# EAGLE design sensors (EAGLE 8.1.1)
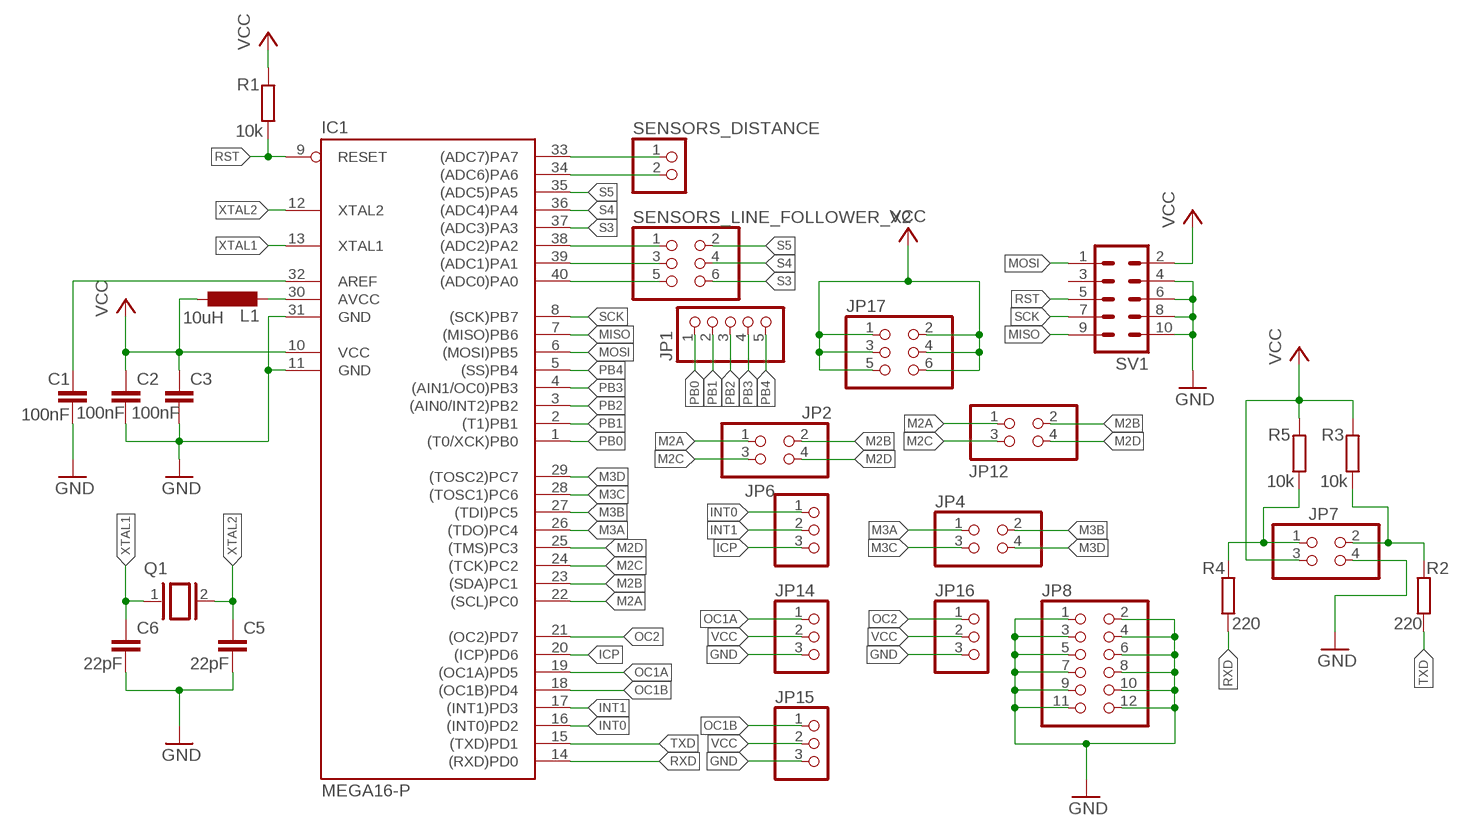
[diagram p0: schematic, sheet 1]

## Parts
C1  100nF  C-EUC0805  [C0805]
C2  100nF  C-EUC0805  [C0805]
C3  100nF  C-EUC0805  [C0805]
C5  22pF  C-EUC0805  [C0805]
C6  22pF  C-EUC0805  [C0805]
IC1  MEGA16-P  [DIL40]
JP1  PINHD-1X5  [1X05]
JP2  PINHD-2X2  [2X02]
JP4  PINHD-2X2  [2X02]
JP6  PINHD-1X3  [1X03]
JP7  PINHD-2X2  [2X02]
JP8  PINHD-2X6  [2X06]
JP12  PINHD-2X2  [2X02]
JP14  PINHD-1X3  [1X03]
JP15  PINHD-1X3  [1X03]
JP16  PINHD-1X3  [1X03]
JP17  PINHD-2X3  [2X03]
L1  10uH  L-EU0207/7  [0207/7]
Q1  XTAL/S  [QS]
R1  10k  R-EU_R0805  [R0805]
R2  220  R-EU_R0805  [R0805]
R3  10k  R-EU_R0805  [R0805]
R4  220  R-EU_R0805  [R0805]
R5  10k  R-EU_R0805  [R0805]
SENSORS_DISTANCE  PINHD-1X2  [1X02]
SENSORS_LINE_FOLLOWER_X2  PINHD-2X3  [2X03]
SV1  ML10  [ML10]

## Nets
ADC6: IC1.34((ADC6)PA6) SENSORS_DISTANCE.2
GND: C1.2 C2.2 C3.2 C5.2 C6.2 IC1.11(GND) IC1.31(GND) JP7.4 JP8.1 JP8.2 JP8.3 JP8.4 JP8.5 JP8.6 JP8.7 JP8.8 JP8.9 JP8.10 JP8.11 JP8.12 JP14.3 JP15.3 JP16.3 SV1.4 SV1.6 SV1.8 SV1.10
ICP: IC1.20((ICP)PD6) JP6.3
INT0: IC1.16((INT0)PD2) JP6.1
INT1: IC1.17((INT1)PD3) JP6.2
M2A: IC1.22((SCL)PC0) JP2.1 JP12.1
M2B: IC1.23((SDA)PC1) JP2.2 JP12.2
M2C: IC1.24((TCK)PC2) JP2.3 JP12.3
M2D: IC1.25((TMS)PC3) JP2.4 JP12.4
M3A: IC1.26((TDO)PC4) JP4.1
M3B: IC1.27((TDI)PC5) JP4.2
M3C: IC1.28((TOSC1)PC6) JP4.3
M3D: IC1.29((TOSC2)PC7) JP4.4
MISO: IC1.7((MISO)PB6) SV1.9
MOSI: IC1.6((MOSI)PB5) SV1.1
N$1: JP7.1 R4.2 R5.1
N$2: JP7.2 R2.2 R3.1
N$3: C1.1 IC1.32(AREF)
N$4: IC1.30(AVCC) L1.2
N$29: IC1.33((ADC7)PA7) SENSORS_DISTANCE.1
OC1A: IC1.19((OC1A)PD5) JP14.1
OC1B: IC1.18((OC1B)PD4) JP15.1
OC2: IC1.21((OC2)PD7) JP16.1
PB0: IC1.1((T0/XCK)PB0) JP1.1
PB1: IC1.2((T1)PB1) JP1.2
PB2: IC1.3((AIN0/INT2)PB2) JP1.3
PB3: IC1.4((AIN1/OC0)PB3) JP1.4
PB4: IC1.5((SS)PB4) JP1.5
RST: IC1.9(RESET) R1.1 SV1.5
RXD: IC1.14((RXD)PD0) R4.1
S0: IC1.40((ADC0)PA0) SENSORS_LINE_FOLLOWER_X2.5
S1: IC1.39((ADC1)PA1) SENSORS_LINE_FOLLOWER_X2.3
S2: IC1.38((ADC2)PA2) SENSORS_LINE_FOLLOWER_X2.1
S3: IC1.37((ADC3)PA3) SENSORS_LINE_FOLLOWER_X2.6
S4: IC1.36((ADC4)PA4) SENSORS_LINE_FOLLOWER_X2.4
S5: IC1.35((ADC5)PA5) SENSORS_LINE_FOLLOWER_X2.2
SCK: IC1.8((SCK)PB7) SV1.7
TXD: IC1.15((TXD)PD1) R2.1
VCC: C2.1 C3.1 IC1.10(VCC) JP7.3 JP14.2 JP15.2 JP16.2 JP17.1 JP17.2 JP17.3 JP17.4 JP17.5 JP17.6 L1.1 R1.2 R3.2 R5.2 SV1.2
XTAL1: C6.1 IC1.13(XTAL1) Q1.1
XTAL2: C5.1 IC1.12(XTAL2) Q1.2
Unconnected: SV1.3

## Library data of the parts
C1-C3 C5 C6 = resistor:C-EU: CAPACITOR, European symbol
IC1 = atmel:MEGA16-P: MICROCONTROLLER 16 Kbytes FLASH 1 kbytes SRAM 512 bytes EEPROM USART 8-channel 10 bit ADC Source: avr.lbr; MPN: ATMEGA16-16PU; OC_FARNELL: 9171142; OC_NEWARK: 01M6885
JP1 = pinhead:PINHD-1X5: PIN HEADER
JP2 JP4 JP7 JP12 = pinhead:PINHD-2X2: PIN HEADER
JP6 JP14-JP16 = pinhead:PINHD-1X3: PIN HEADER
JP8 = pinhead:PINHD-2X6: PIN HEADER
JP17 SENSORS_LINE_FOLLOWER_X2 = pinhead:PINHD-2X3: PIN HEADER
L1 = resistor:L-EU: INDUCTOR, European symbol
Q1 = special:XTAL/S: CRYSTAL
R1-R5 = resistor:R-EU_: RESISTOR, European symbol
SENSORS_DISTANCE = pinhead:PINHD-1X2: PIN HEADER
SV1 = con-ml:ML10: HARTING; OC_FARNELL: unknown; OC_NEWARK: unknown

## Board
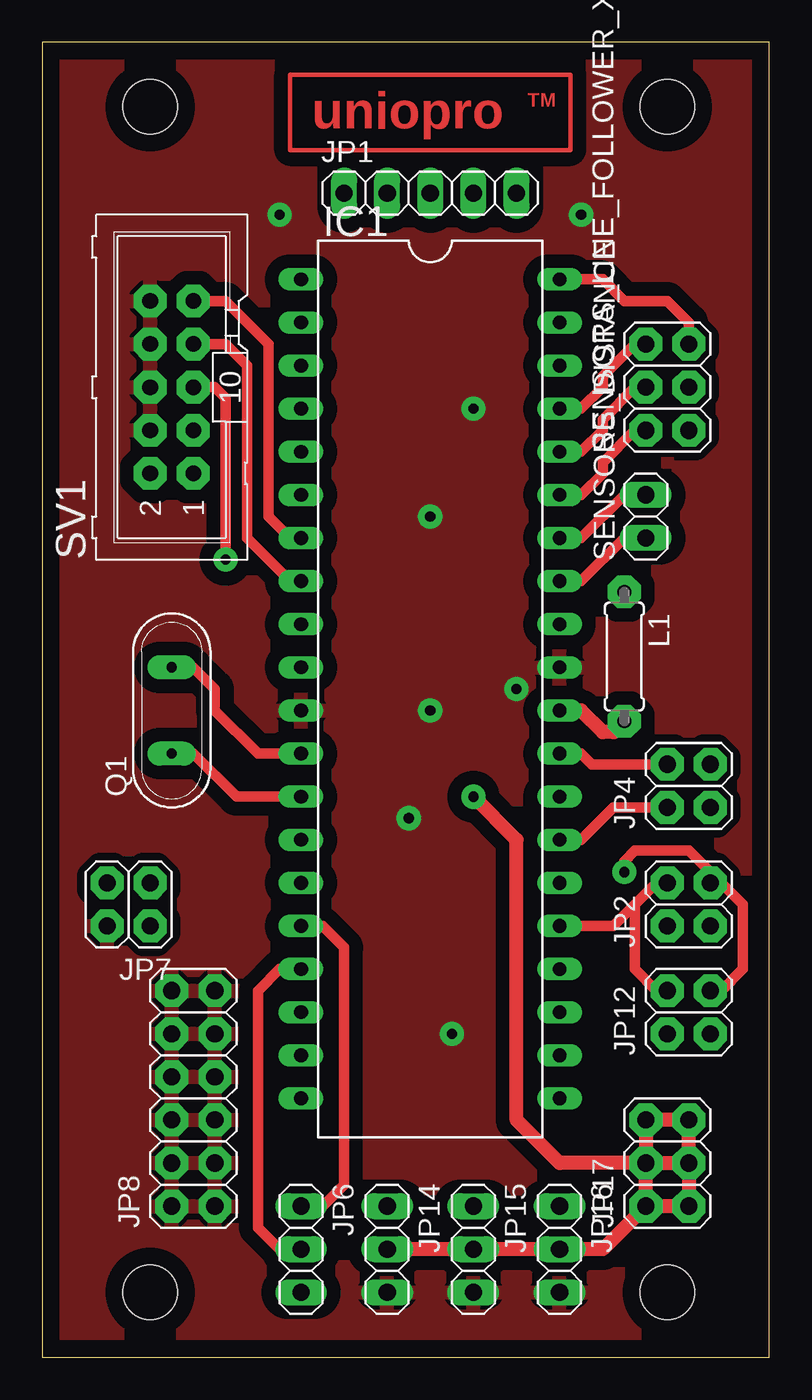
[diagram p1: board, top side]
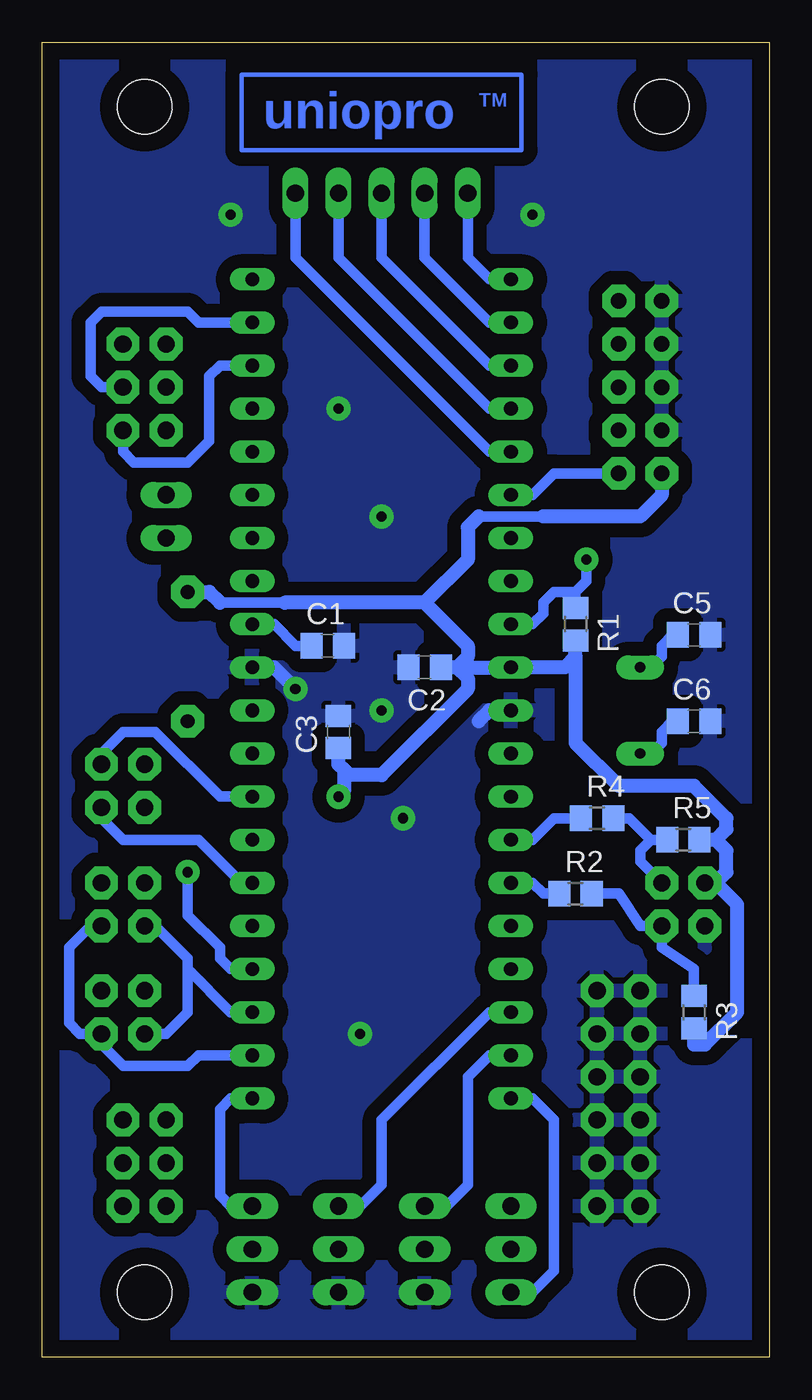
[diagram p2: board, bottom side, seen from below]

Size 42.85 x 77.46 mm. Coordinates in mm from the lower left corner, seen from the top.
Outline: 0,0 42.85,0 42.85,77.46 0,77.46 0,0
Copper layers (1*16): Top 0.035mm / dielectric 1.5mm / Bottom 0.035mm
Design rules "default": minimum track width 10mil, minimum drill 24mil, track to track 8mil, track to pad 8mil, pad to pad 8mil, via to via 8mil, smd to smd 8mil, copper to edge 40mil, drill to drill 8mil, minimum pad ring 10mil, minimum via ring 8mil, stop-mask expansion 4mil, vias tented up to drill 0mil, thermal gap 10mil
Holes 3.2 mm at 36.83,3.81 6.35,3.81 6.35,73.66 36.83,73.66

### Footprints (pad centres in the part's own frame; a part is rotated, then mirrored left to right if it is on the bottom)
C0805 = smd 1.3 x 1.5: 1 -0.95,0; 2 0.95,0
DIL40 = drill 0.813 long: 1 -24.13,-7.62; 2 -21.59,-7.62; 3 -19.05,-7.62; 4 -16.51,-7.62; 5 -13.97,-7.62; 6 -11.43,-7.62; 7 -8.89,-7.62; 8 -6.35,-7.62; 9 -3.81,-7.62; 10 -1.27,-7.62; 11 1.27,-7.62; 12 3.81,-7.62; 13 6.35,-7.62; 14 8.89,-7.62; 15 11.43,-7.62; 16 13.97,-7.62; 17 16.51,-7.62; 18 19.05,-7.62; 19 21.59,-7.62; 20 24.13,-7.62; 21 24.13,7.62; 22 21.59,7.62; 23 19.05,7.62; 24 16.51,7.62; 25 13.97,7.62; 26 11.43,7.62; 27 8.89,7.62; 28 6.35,7.62; 29 3.81,7.62; 30 1.27,7.62; 31 -1.27,7.62; 32 -3.81,7.62; 33 -6.35,7.62; 34 -8.89,7.62; 35 -11.43,7.62; 36 -13.97,7.62; 37 -16.51,7.62; 38 -19.05,7.62; 39 -21.59,7.62; 40 -24.13,7.62
1X05 = drill 1.016 long: 1 -5.08,0; 2 -2.54,0; 3 0,0; 4 2.54,0; 5 5.08,0
2X02 = drill 1.016 pad 1.93 octagon: 1 -1.27,-1.27; 2 -1.27,1.27; 3 1.27,-1.27; 4 1.27,1.27
1X03 = drill 1.016 long: 1 -2.54,0; 2 0,0; 3 2.54,0
2X06 = drill 1.016 pad 1.93 octagon: 1 -6.35,-1.27; 2 -6.35,1.27; 3 -3.81,-1.27; 4 -3.81,1.27; 5 -1.27,-1.27; 6 -1.27,1.27; 7 1.27,-1.27; 8 1.27,1.27; 9 3.81,-1.27; 10 3.81,1.27; 11 6.35,-1.27; 12 6.35,1.27
2X03 = drill 1.016 pad 1.93 octagon: 1 -2.54,-1.27; 2 -2.54,1.27; 3 0,-1.27; 4 0,1.27; 5 2.54,-1.27; 6 2.54,1.27
0207/7 = drill 0.813 pad 1.93 octagon: 1 -3.81,0; 2 3.81,0
QS = drill 0.61 pad 1.422 long: 1 -2.54,0; 2 2.54,0
R0805 = smd 1.3 x 1.5: 1 -0.95,0; 2 0.95,0
1X02 = drill 1.016 long: 1 -1.27,0; 2 1.27,0
ML10 = drill 0.914 pad 1.93 octagon: 1 -5.08,-1.27; 2 -5.08,1.27; 3 -2.54,-1.27; 4 -2.54,1.27; 5 0,-1.27; 6 0,1.27; 7 2.54,-1.27; 8 2.54,1.27; 9 5.08,-1.27; 10 5.08,1.27

### Placement (x,y rotation side)
C1  26.04,41.91 0 bottom
C2  20.32,40.64 180 bottom
C3  25.4,36.83 90 bottom
C5  4.45,42.55 0 bottom
C6  4.45,37.47 0 bottom
IC1  22.86,39.37 270 top
JP1  22.86,68.58 0 top
JP2  38.1,26.67 90 top
JP4  38.1,33.66 90 top
JP6  15.24,6.35 270 top
JP7  5.08,26.67 180 top
JP8  8.89,15.24 90 top
JP12  38.1,20.32 90 top
JP14  20.32,6.35 270 top
JP15  25.4,6.35 270 top
JP16  30.48,6.35 270 top
JP17  36.83,11.43 90 top
L1  34.29,41.27 270 top
Q1  7.62,38.1 90 top
R1  11.43,43.18 270 bottom
R2  11.43,27.3 0 bottom
R3  4.45,20.32 270 bottom
R4  10.16,31.75 0 bottom
R5  5.08,30.48 0 bottom
SENSORS_DISTANCE  35.56,49.53 90 top
SENSORS_LINE_FOLLOWER_X2  36.83,57.15 90 top
SV1  7.62,57.15 90 top

### Tracks (layer width: path | path; a pad name or v marks a point on that pad's centre or on a via)
ADC6
  Top 0.61: SENSORS_DISTANCE.2 34.29,50.8 31.75,48.26 IC1.34
GND  (via drill 0.6 pad 1.42)
  Bottom 0.813: IC1.11 16.51,38.1 17.14,37.47 | v27.94,39.37 29.21,40.64 IC1.31
  other vias: 21.59,31.75 22.86,38.1 22.86,49.53 25.4,55.88 13.97,67.31 31.75,67.31 24.13,19.05
  pour Bottom (isolate 0.813): 0,77.47 43.18,77.47 43.18,0 0,0
  pour Top (isolate 0.813): 0,77.47 43.18,77.47 43.18,0 0,0
ICP
  Bottom 0.61: JP6.3 13.97,3.81 12.7,5.08 12.7,13.97 13.97,15.24 IC1.20
INT0
  Top 0.61: JP6.1 16.51,8.89 17.78,10.16 17.78,24.13 16.51,25.4 IC1.16
INT1
  Top 0.61: JP6.2 13.97,6.35 12.7,7.62 12.7,21.59 13.97,22.86 IC1.17
M2A
  Bottom 0.61: JP2.1 40.01,25.4 41.27,24.13 41.27,19.68 40.64,19.05 JP12.1 39.37,18.41 38.1,17.14 34.29,17.14 33.66,17.78 IC1.22
M2B
  Bottom 0.61: JP2.2 36.2,25.4 34.29,23.5 34.29,22.86 | 34.29,22.86 34.29,20.32 35.56,19.05 JP12.2 | IC1.23 31.75,20.32 34.29,22.86
M2C  (via drill 0.6 pad 1.42)
  Top 0.61: v34.29,28.57 34.29,29.21 34.92,29.84 38.1,29.84 39.37,28.57 JP2.3 40.01,27.94 41.27,26.67 41.27,22.86 40.01,21.59 JP12.3
  Bottom 0.61: IC1.24 31.75,22.86 32.38,23.5 32.38,24.13 34.29,26.04 v34.29,28.57
M2D
  Top 0.61: JP12.4 36.2,21.59 34.92,22.86 34.92,26.67 | 34.92,26.67 36.2,27.94 JP2.4 | 34.92,26.67 33.66,25.4 IC1.25
M3A
  Bottom 0.61: JP4.1 39.37,31.75 38.1,30.48 33.66,30.48 31.11,27.94 IC1.26
M3B
  Top 0.61: IC1.27 31.75,30.48 33.66,32.38 JP4.2
M3C
  Bottom 0.61: JP4.3 39.37,35.56 38.1,36.83 36.2,36.83 32.38,33.02 IC1.28
M3D
  Top 0.61: IC1.29 31.75,35.56 32.38,34.92 JP4.4
MISO
  Top 0.61: IC1.7 14.61,48.26 13.34,49.53 13.34,59.69 10.79,62.23 SV1.9
MOSI
  Bottom 0.61: IC1.6 13.97,50.8 12.7,52.07 SV1.1
N$1
  Bottom 0.61: 6.99,30.48 7.62,29.84 7.62,29.21 JP7.1 | 6.99,30.48 R5.1 | R4.2 8.26,31.75 6.99,30.48
N$2
  Bottom 0.61: R2.2 8.89,27.3 7.62,25.4 JP7.2 6.35,24.13 4.45,22.86 R3.1
N$3
  Bottom 0.61: C1.1 27.94,41.91 29.21,43.18 IC1.32
N$4
  Top 0.813: L1.2 33.66,36.83 33.02,36.83 31.75,38.1 IC1.30
N$29
  Top 0.61: IC1.33 31.75,45.72 34.29,48.26 SENSORS_DISTANCE.1
OC1A
  Bottom 0.61: JP14.1 19.05,8.89 17.78,10.16 17.78,16.51 16.51,17.78 IC1.19
OC1B
  Bottom 0.61: JP15.1 24.13,8.89 22.86,10.16 22.86,13.97 16.51,20.32 IC1.18
OC2
  Bottom 0.61: IC1.21 31.75,15.24 32.38,14.61 32.38,9.53 31.75,8.89 JP16.1
PB0
  Bottom 0.61: IC1.1 16.51,63.5 17.78,64.77 JP1.1
PB1
  Bottom 0.61: IC1.2 16.51,60.96 20.32,64.77 JP1.2
PB2
  Bottom 0.61: IC1.3 16.51,58.42 22.86,64.77 JP1.3
PB3
  Bottom 0.61: IC1.4 16.51,55.88 25.4,64.77 JP1.4
PB4
  Bottom 0.61: IC1.5 16.51,53.34 27.94,64.77 JP1.5
RAMKAB
  Bottom 0.254: 14.61,71.12 31.11,71.12 31.11,75.56 14.61,75.56 14.61,71.12
RAMKAT
  Top 0.254: 14.61,71.12 31.11,71.12 31.11,75.56 14.61,75.56 14.61,71.12
RST  (via drill 0.6 pad 1.42)
  Top 0.61: SV1.5 10.16,57.15 10.79,56.52 v10.79,46.99
  Bottom 0.61: IC1.9 13.97,43.18 13.34,43.81 13.34,44.45 12.7,45.09 11.43,45.09 | R1.1 11.43,45.09 | 11.43,45.09 10.79,45.72 v10.79,46.99
RXD
  Bottom 0.61: IC1.14 13.97,30.48 12.7,31.75 R4.1
S0
  Top 0.61: SENSORS_LINE_FOLLOWER_X2.5 38.1,60.96 36.83,62.23 34.29,62.23 33.02,63.5 IC1.40
S1
  Bottom 0.61: SENSORS_LINE_FOLLOWER_X2.3 39.37,57.15 40.01,57.78 40.01,60.96 39.37,61.59 34.29,61.59 33.66,60.96 IC1.39
S2
  Bottom 0.61: SENSORS_LINE_FOLLOWER_X2.1 38.1,53.34 37.47,52.7 34.29,52.7 33.02,53.98 33.02,57.78 32.38,58.42 IC1.38
S3
  Top 0.61: IC1.37 31.75,55.88 33.02,57.15 33.02,57.78 34.92,59.69 SENSORS_LINE_FOLLOWER_X2.6
S4
  Top 0.61: IC1.36 31.75,53.34 33.02,54.61 33.02,55.24 34.92,57.15 SENSORS_LINE_FOLLOWER_X2.4
S5
  Top 0.61: IC1.35 31.75,50.8 33.02,52.07 33.02,52.7 34.92,54.61 SENSORS_LINE_FOLLOWER_X2.2
SCK
  Top 0.61: IC1.8 14.61,45.72 12.06,48.26 12.06,58.42 10.79,59.69 SV1.7
TXD
  Bottom 0.61: IC1.15 13.97,27.94 13.34,27.3 R2.1
VCC  (via drill 0.6 pad 1.42)
  Top 0.813: JP17.4 JP17.6 JP17.5 JP17.3 | JP17.2 JP17.4 | JP17.2 33.02,6.35 JP16.2 JP15.2 JP14.2 | JP17.3 JP17.1 JP17.2 | JP17.4 JP17.3 | JP17.4 30.48,11.43 27.94,13.97 27.94,30.48 v25.4,33.02
  Bottom 0.61: 28.57,44.45 32.38,44.45 | 13.34,49.53 17.14,49.53
  Bottom 0.813: 3.17,27.94 2.54,28.57 2.54,29.84 3.17,30.48 | 3.17,30.48 R5.2 | 3.17,30.48 2.54,31.11 2.54,31.75 4.45,33.66 8.89,33.66 11.43,36.2 11.43,41.27 | 11.43,41.27 R1.2 | 11.43,41.27 12.06,40.64 IC1.10 18.41,40.64 | 18.41,40.64 C2.1 | 25.4,35.56 C3.1 25.4,34.92 25.08,34.61 | 18.41,40.64 17.78,40.01 17.78,39.37 22.86,34.29 24.77,34.29 25.08,34.61 | 25.08,34.61 25.08,33.34 v25.4,33.02 | L1.1 33.02,45.09 32.38,44.45 | 20.32,44.45 17.78,41.91 17.78,41.27 18.41,40.64 | 20.32,44.45 28.57,44.45 | SV1.2 6.35,50.8 7.62,49.53 13.34,49.53 | 17.14,49.53 17.78,48.9 17.78,46.99 20.32,44.45 | 3.17,27.94 JP7.3 | R3.2 4.45,18.41 3.81,18.41 1.91,20.32 1.91,26.67 3.17,27.94
XTAL1
  Top 0.61: Q1.1 8.89,35.56 11.43,33.02 IC1.13
  Bottom 0.61: Q1.1 6.99,35.56 6.35,36.2 6.35,36.83 5.71,37.47 C6.1
XTAL2
  Top 0.61: IC1.12 12.7,35.56 10.16,38.1 10.16,39.37 8.89,40.64 Q1.2
  Bottom 0.61: Q1.2 6.99,40.64 6.35,41.27 6.35,41.91 5.71,42.55 C5.1

### Text on the board
Top: TM | uniopro
Bottom: TM | uniopro